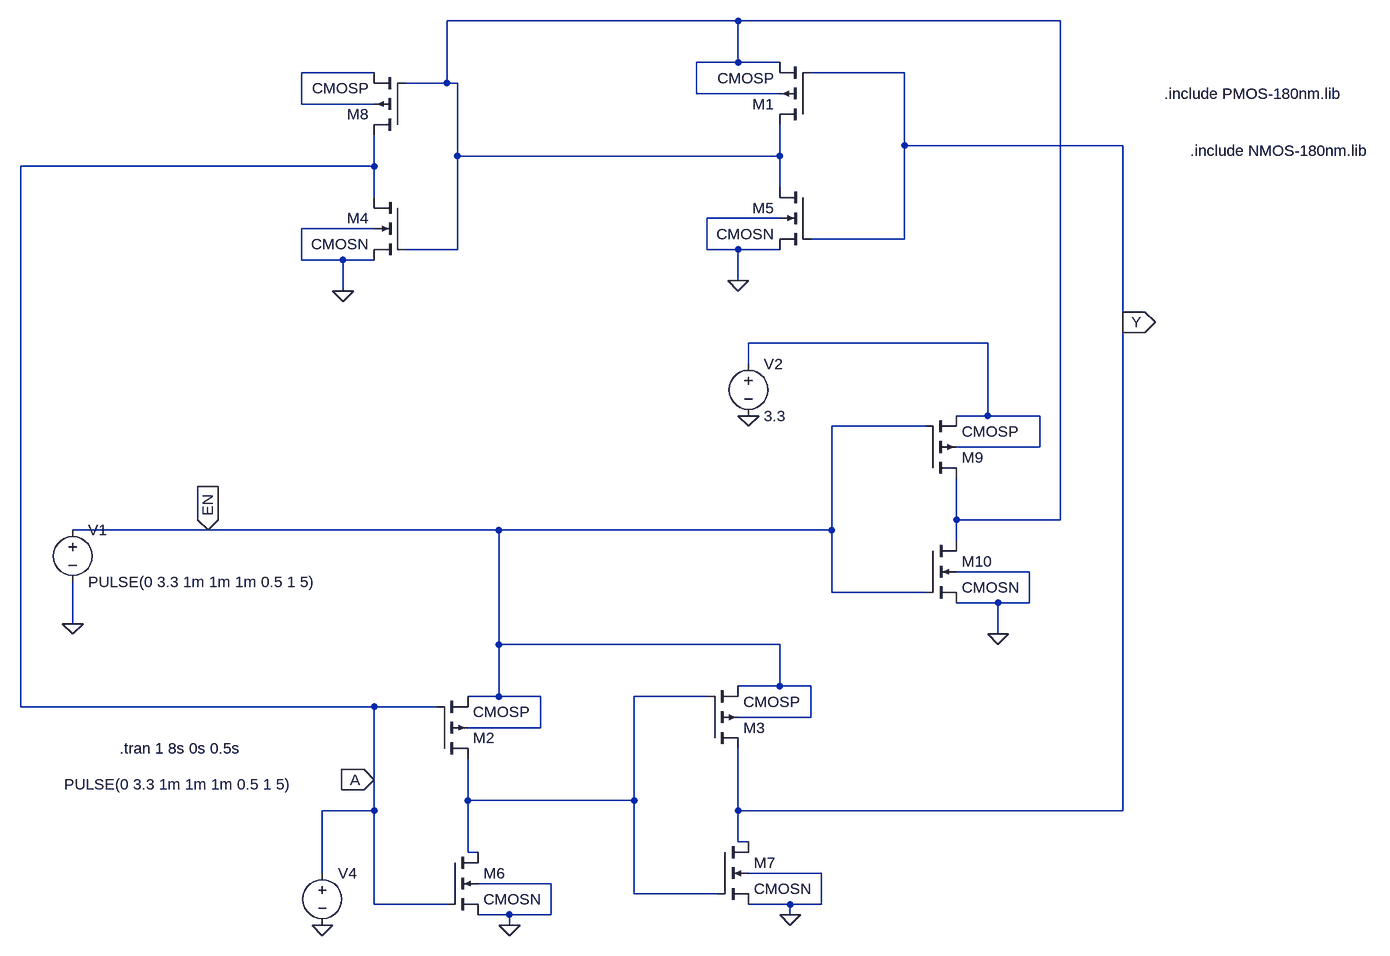
[diagram p0: schematic portAtoB.asc]
portAtoB.asc, the LTspice schematic file:
Version 4
SHEET 1 2520 1616
WIRE 1136 -64 688 -64
WIRE 1632 -64 1136 -64
WIRE 1136 0 1136 -64
WIRE 1136 0 1072 0
WIRE 1200 0 1136 0
WIRE 576 16 464 16
WIRE 1392 16 1248 16
WIRE 688 32 688 -64
WIRE 688 32 624 32
WIRE 704 32 688 32
WIRE 1072 48 1072 0
WIRE 1200 48 1072 48
WIRE 464 64 464 16
WIRE 576 64 464 64
WIRE 1392 128 1392 16
WIRE 1728 128 1392 128
WIRE 704 144 704 32
WIRE 1200 144 1200 96
WIRE 1200 144 704 144
WIRE 576 160 576 112
WIRE 576 160 32 160
WIRE 1200 192 1200 144
WIRE 576 208 576 160
WIRE 1200 240 1088 240
WIRE 576 256 464 256
WIRE 1392 272 1392 128
WIRE 1392 272 1248 272
WIRE 704 288 704 144
WIRE 704 288 624 288
WIRE 1088 288 1088 240
WIRE 1136 288 1088 288
WIRE 1200 288 1136 288
WIRE 464 304 464 256
WIRE 528 304 464 304
WIRE 576 304 528 304
WIRE 1136 336 1136 288
WIRE 528 352 528 304
WIRE 1728 400 1728 128
WIRE 1520 432 1152 432
WIRE 1152 464 1152 432
WIRE 1520 544 1520 432
WIRE 1520 544 1472 544
WIRE 1600 544 1520 544
WIRE 1424 560 1280 560
WIRE 1600 592 1600 544
WIRE 1600 592 1472 592
WIRE 1472 704 1472 640
WIRE 1632 704 1632 -64
WIRE 1632 704 1472 704
WIRE 320 720 112 720
WIRE 768 720 320 720
WIRE 1280 720 1280 560
WIRE 1280 720 768 720
WIRE 1472 736 1472 704
WIRE 1584 784 1472 784
WIRE 1280 816 1280 720
WIRE 1424 816 1280 816
WIRE 1536 832 1472 832
WIRE 1584 832 1584 784
WIRE 1584 832 1536 832
WIRE 112 864 112 800
WIRE 1536 880 1536 832
WIRE 768 896 768 720
WIRE 1200 896 768 896
WIRE 1200 960 1200 896
WIRE 1200 960 1136 960
WIRE 1248 960 1200 960
WIRE 768 976 768 896
WIRE 768 976 720 976
WIRE 832 976 768 976
WIRE 1088 976 976 976
WIRE 32 992 32 160
WIRE 576 992 32 992
WIRE 672 992 576 992
WIRE 1248 1008 1248 960
WIRE 1248 1008 1136 1008
WIRE 832 1024 832 976
WIRE 832 1024 720 1024
WIRE 576 1104 576 992
WIRE 720 1136 720 1072
WIRE 976 1136 976 976
WIRE 976 1136 720 1136
WIRE 576 1152 576 1104
WIRE 576 1152 496 1152
WIRE 1136 1152 1136 1056
WIRE 1728 1152 1728 400
WIRE 1728 1152 1136 1152
WIRE 1136 1200 1136 1152
WIRE 1152 1200 1136 1200
WIRE 720 1216 720 1136
WIRE 736 1216 720 1216
WIRE 496 1248 496 1152
WIRE 1264 1248 1152 1248
WIRE 848 1264 736 1264
WIRE 976 1280 976 1136
WIRE 1104 1280 976 1280
WIRE 576 1296 576 1152
WIRE 688 1296 576 1296
WIRE 1216 1296 1152 1296
WIRE 1264 1296 1264 1248
WIRE 1264 1296 1216 1296
WIRE 784 1312 736 1312
WIRE 848 1312 848 1264
WIRE 848 1312 784 1312
WIRE 1216 1312 1216 1296
WIRE 784 1328 784 1312
FLAG 528 352 0
FLAG 1136 336 0
FLAG 112 864 0
FLAG 1728 400 Y
IOPIN 1728 400 Out
FLAG 320 720 EN
IOPIN 320 720 In
FLAG 784 1328 0
FLAG 1216 1312 0
FLAG 576 1104 A
IOPIN 576 1104 In
FLAG 1536 880 0
FLAG 1152 544 0
FLAG 496 1328 0
SYMBOL voltage 112 704 R0
WINDOW 123 0 0 Left 0
WINDOW 39 0 0 Left 0
SYMATTR InstName V1
SYMATTR Value PULSE(0 3.3 1m 1m 1m 0.5 1 5)
SYMBOL pmos4 1248 96 R180
SYMATTR InstName M1
SYMATTR Value CMOSP
SYMATTR Value2 l=180n w=900n m=1
SYMBOL pmos4 672 1072 M180
SYMATTR InstName M2
SYMATTR Value CMOSP
SYMATTR Value2 l=180n w=900n m=1
SYMBOL pmos4 1088 1056 M180
SYMATTR InstName M3
SYMATTR Value CMOSP
SYMATTR Value2 l=180n w=900n m=1
SYMBOL nmos4 624 208 M0
SYMATTR InstName M4
SYMATTR Value CMOSN
SYMATTR Value2 l=180n w=360n
SYMBOL nmos4 1248 192 M0
SYMATTR InstName M5
SYMATTR Value CMOSN
SYMATTR Value2 l=180n w=360n
SYMBOL nmos4 688 1216 R0
SYMATTR InstName M6
SYMATTR Value CMOSN
SYMATTR Value2 l=180n w=360n
SYMBOL nmos4 1104 1200 R0
SYMATTR InstName M7
SYMATTR Value CMOSN
SYMATTR Value2 l=180n w=360n
SYMBOL pmos4 624 112 R180
SYMATTR InstName M8
SYMATTR Value CMOSP
SYMATTR Value2 l=180n w=900n m=1
SYMBOL pmos4 1424 640 M180
SYMATTR InstName M9
SYMATTR Value CMOSP
SYMATTR Value2 l=180n w=900n m=1
SYMBOL nmos4 1424 736 R0
SYMATTR InstName M10
SYMATTR Value CMOSN
SYMATTR Value2 l=180n w=360n
SYMBOL voltage 1152 448 R0
WINDOW 123 0 0 Left 0
WINDOW 39 0 0 Left 0
SYMATTR InstName V2
SYMATTR Value 3.3
SYMBOL voltage 496 1232 R0
WINDOW 123 0 0 Left 0
WINDOW 39 0 0 Left 0
WINDOW 3 -397 -121 Left 2
SYMATTR Value PULSE(0 3.3 1m 1m 1m 0.5 1 5)
SYMATTR InstName V4
TEXT 1792 48 Left 2 !.include PMOS-180nm.lib
TEXT 1832 136 Left 2 !.include NMOS-180nm.lib
TEXT 184 1056 Left 2 !.tran 1 8s 0s 0.5s

The netlist it stands for:
* portAtoB.asc
V1 EN 0 PULSE(0 3.3 1m 1m 1m 0.5 1 5)
M1 N001 Y N001 N001 CMOSP l=180n w=900n m=1
M2 N004 A EN EN CMOSP l=180n w=900n m=1
M3 Y N004 EN EN CMOSP l=180n w=900n m=1
M4 A N001 0 0 CMOSN l=180n w=360n
M5 N001 Y 0 0 CMOSN l=180n w=360n
M6 N004 A 0 0 CMOSN l=180n w=360n
M7 Y N004 0 0 CMOSN l=180n w=360n
M8 A N001 N002 N002 CMOSP l=180n w=900n m=1
M9 N001 EN N003 N003 CMOSP l=180n w=900n m=1
M10 N001 EN 0 0 CMOSN l=180n w=360n
V2 N003 0 3.3
V4 A 0 PULSE(0 3.3 1m 1m 1m 0.5 1 5)
.model NMOS NMOS
.model PMOS PMOS
.lib standard.mos
.include PMOS-180nm.lib
.include NMOS-180nm.lib
.tran 1 8s 0s 0.5s
.backanno
.end